# EAGLE design 85veegashield_v2 (EAGLE 7.5.0)
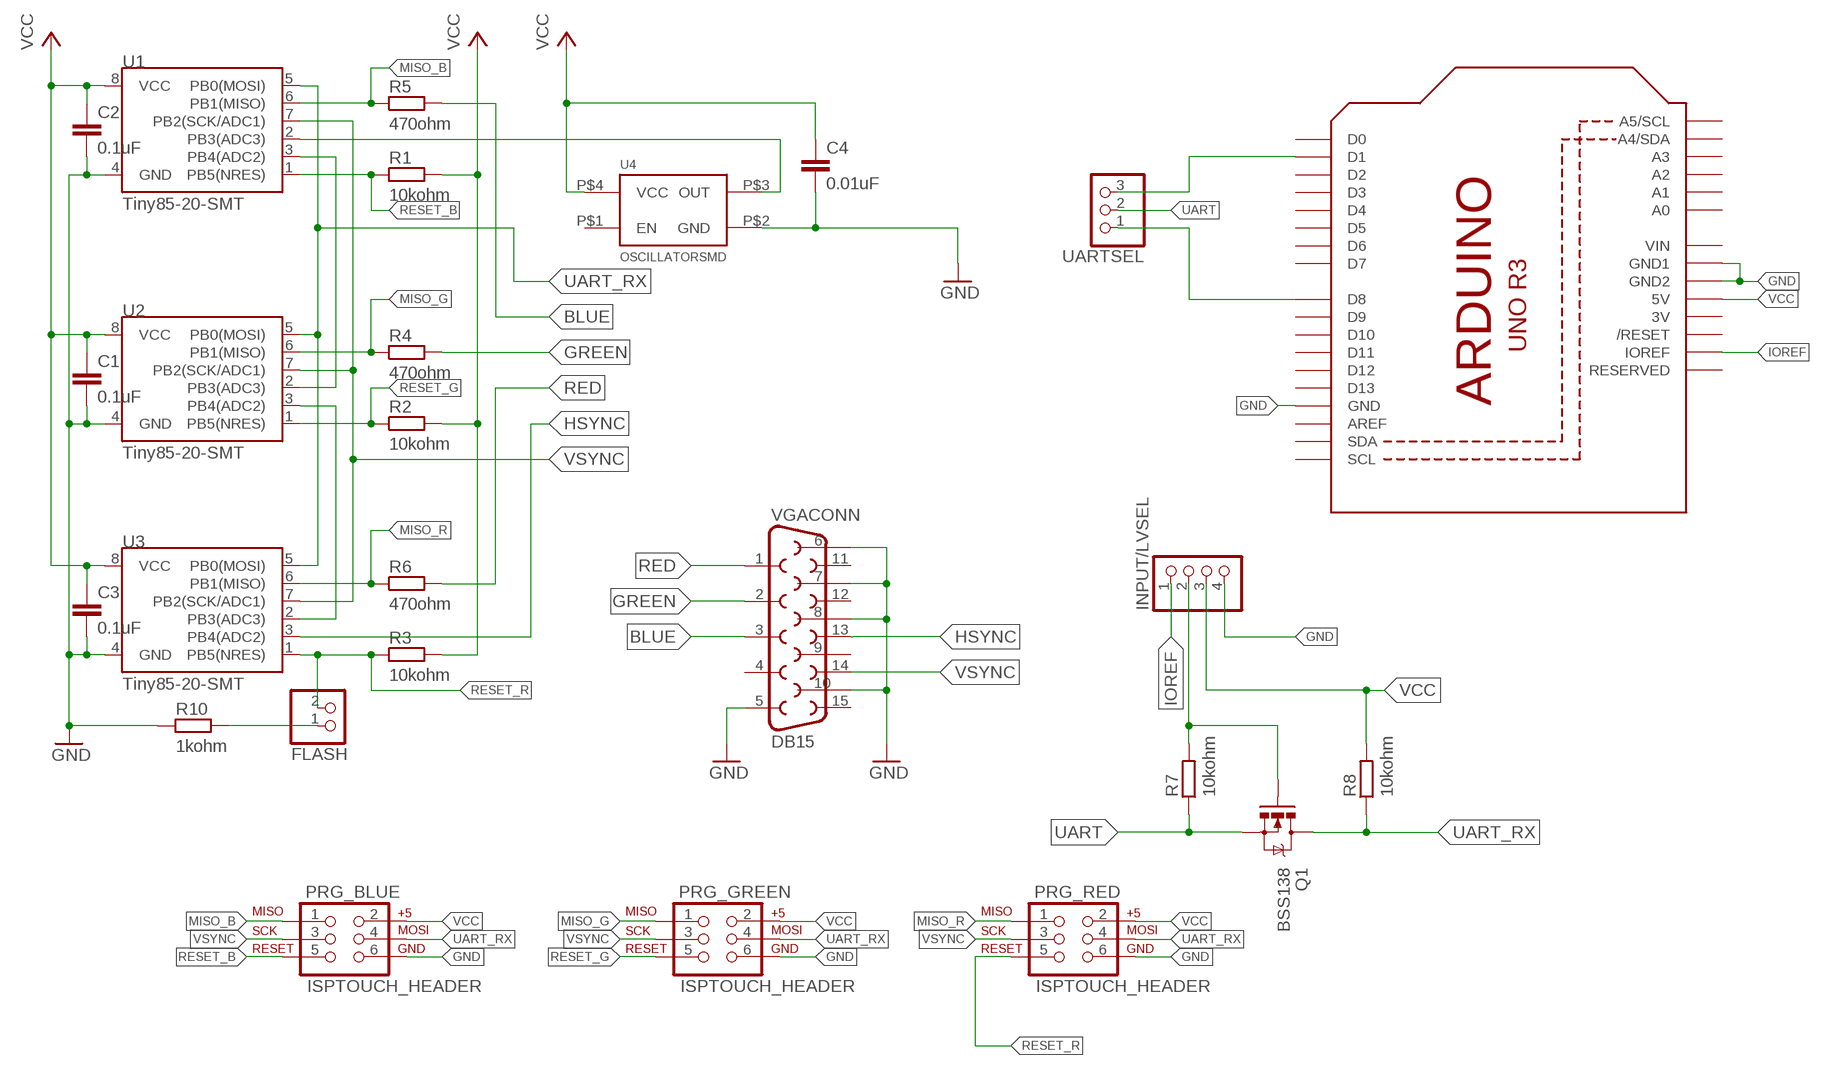
[diagram p0: schematic, sheet 1]

## Parts
C1  0.1uF  CAP0603-CAP  [0603-CAP]
C2  0.1uF  CAP0603-CAP  [0603-CAP]
C3  0.1uF  CAP0603-CAP  [0603-CAP]
C4  0.01uF  CAP0603-CAP  [0603-CAP]
FLASH  PINHD-1X02_2.54-S  [1X02-S]
INPUT/LVSEL  PINHD-1X04_2.54-S  [1X04-S]
PRG_BLUE  ISPTOUCH_HEADER  [AVX_9188_6-WAY_MATING_GUIDE]
PRG_GREEN  ISPTOUCH_HEADER  [AVX_9188_6-WAY_MATING_GUIDE]
PRG_RED  ISPTOUCH_HEADER  [AVX_9188_6-WAY_MATING_GUIDE]
Q1  BSS138  MOSFET-NCHANNELBSS138  [SOT23]
R1  10kohm  RESISTOR  [R0603]
R2  10kohm  RESISTOR  [R0603]
R3  10kohm  RESISTOR  [R0603]
R4  470ohm  RESISTOR  [R0603]
R5  470ohm  RESISTOR  [R0603]
R6  470ohm  RESISTOR  [R0603]
R7  10kohm  RESISTOR  [R0603]
R8  10kohm  RESISTOR  [R0603]
R10  1kohm  RESISTOR  [R0603]
U1  Tiny85-20-SMT  ATTINY45TINY85-20-SMT  [SO08-EIAJ]
U2  Tiny85-20-SMT  ATTINY45TINY85-20-SMT  [SO08-EIAJ]
U3  Tiny85-20-SMT  ATTINY45TINY85-20-SMT  [SO08-EIAJ]
U4  OSCILLATORSMD  [CRYSTAL-SMD-7X5]
U$1  ARDUINOR3-DIMENSION  [ARDUINOR3]
UARTSEL  PINHD-1X03_2.54-S  [1X03-S]
VGACONN  DB15  [DB15]

## Nets
BLUE: R5.2 VGACONN.3
FOO: INPUT/LVSEL.2 Q1.1(G) R7.2
GND: C1.2 C2.2 C3.2 C4.2 INPUT/LVSEL.4 PRG_BLUE.6 PRG_GREEN.6 PRG_RED.6 R10.1 U1.4(GND) U2.4(GND) U3.4(GND) U4.P$2(GND) U$1.GND U$1.GND1 U$1.GND2 VGACONN.5 VGACONN.6 VGACONN.7 VGACONN.8 VGACONN.10
GREEN: R4.2 VGACONN.2
HSYNC: U3.3(PB4(ADC2)) VGACONN.13
IOREF: INPUT/LVSEL.1 U$1.IOREF
MISO_B: PRG_BLUE.1 R5.1 U1.6(PB1(MISO))
MISO_G: PRG_GREEN.1 R4.1 U2.6(PB1(MISO))
MISO_R: PRG_RED.1 R6.1 U3.6(PB1(MISO))
N$1: U1.2(PB3(ADC3)) U4.P$3(OUT)
N$2: U1.3(PB4(ADC2)) U2.2(PB3(ADC3))
N$3: U2.3(PB4(ADC2)) U3.2(PB3(ADC3))
N$4: U$1.D1 UARTSEL.3
N$6: FLASH.1 R10.2
N$11: U$1.D8 UARTSEL.1
RED: R6.2 VGACONN.1
RESET_B: PRG_BLUE.5 R1.1 U1.1(PB5(NRES))
RESET_G: PRG_GREEN.5 R2.1 U2.1(PB5(NRES))
RESET_R: FLASH.2 PRG_RED.5 R3.1 U3.1(PB5(NRES))
UART: Q1.2(S) R7.1 UARTSEL.2
UART_RX: PRG_BLUE.4 PRG_GREEN.4 PRG_RED.4 Q1.3(D) R8.1 U1.5(PB0(MOSI)) U2.5(PB0(MOSI)) U3.5(PB0(MOSI))
VCC: C1.1 C2.1 C3.1 C4.1 INPUT/LVSEL.3 PRG_BLUE.2 PRG_GREEN.2 PRG_RED.2 R1.2 R2.2 R3.2 R8.2 U1.8(VCC) U2.8(VCC) U3.8(VCC) U4.P$4(VCC) U$1.5V
VSYNC: PRG_BLUE.3 PRG_GREEN.3 PRG_RED.3 U1.7(PB2(SCK/ADC1)) U2.7(PB2(SCK/ADC1)) U3.7(PB2(SCK/ADC1)) VGACONN.14
Unconnected: U4.P$1(EN) U$1.A0 U$1.A1 U$1.A2 U$1.A3 U$1.A4(A4/SDA) U$1.A5(A5/SCL) U$1.AREF U$1.D0 U$1.D2 U$1.D3 U$1.D4 U$1.D5 U$1.D6 U$1.D7 U$1.D9 U$1.D10 U$1.D11 U$1.D12 U$1.D13 U$1.RESERVED U$1.RESET(/RESET) U$1.SCL U$1.SDA VGACONN.4 VGACONN.9 VGACONN.11 VGACONN.12 VGACONN.15

## Power pins joined to a net without a drawn wire
3V: U$1.3V
VIN: U$1.VIN

## Library data of the parts
C1-C4 = SparkFun-Capacitors:CAP: Capacitor Standard 0603 ceramic capacitor, and 0.1" leaded capacitor.
FLASH = pinhead-2:PINHD-1X02: PIN HEADER
INPUT/LVSEL = pinhead-2:PINHD-1X04: PIN HEADER
PRG_BLUE PRG_GREEN PRG_RED = prg_header:ISPTOUCH: ISPtouch for AVR Microcontrollers This 6-pin ISP connector for AVR programming does not require any part on the PCB, but an adapter for a common 6-pin programmer.
Q1 = SparkFun-DiscreteSemi:MOSFET-NCHANNEL: Common NMOSFET Parts MFG P/N Store ID Prod ID FDD8780 TRANS-09984 SI7820DN TRANS-11055 FDS6630A IC-08089 2N7002PW TRANS-11151 FQP30N06L COM-10213 TRANS-10060 BSS123LT1G TRANS-08345 BSS138 TRANS-00830 BS170 2N7000; PROD_ID: TRANS-00830
R1-R8 R10 = BaseApp:RESISTOR: Resistance Package :- 0603 Mount :-Surface mount
U1-U3 = SparkFun-DigitalIC:ATTINY45: Atmel 8-pin 2/4/8kB flash uC; PROD_ID: IC-09092
U4 = SparkFun-FreqCtrl:OSCILLATOR: Generic 5x3 and 7x5 oscillators
U$1 = adafruit:ARDUINOR3: This is a new object for the new Arduino R3 - with extra pins that you may want to use (such as IOref, and duplicated A4/A5
UARTSEL = pinhead-2:PINHD-1X03: PIN HEADER
VGACONN = SparkFun-Connectors:DB15: DB15 / VGA right angle through-hole female connector.

## Board
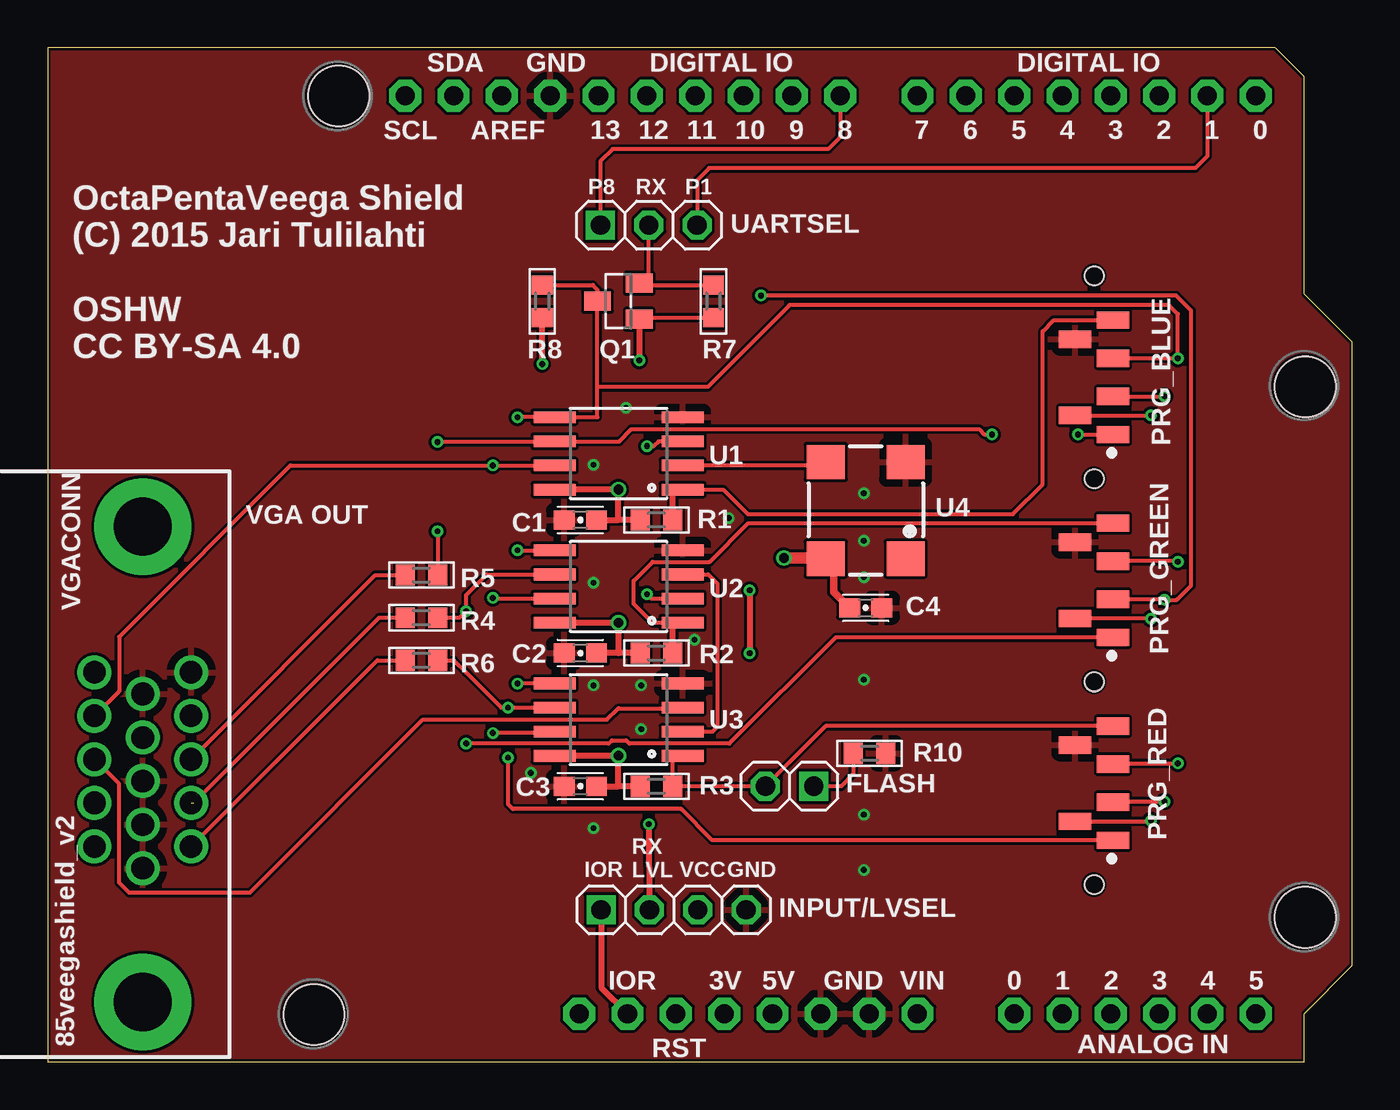
[diagram p1: board, top side]
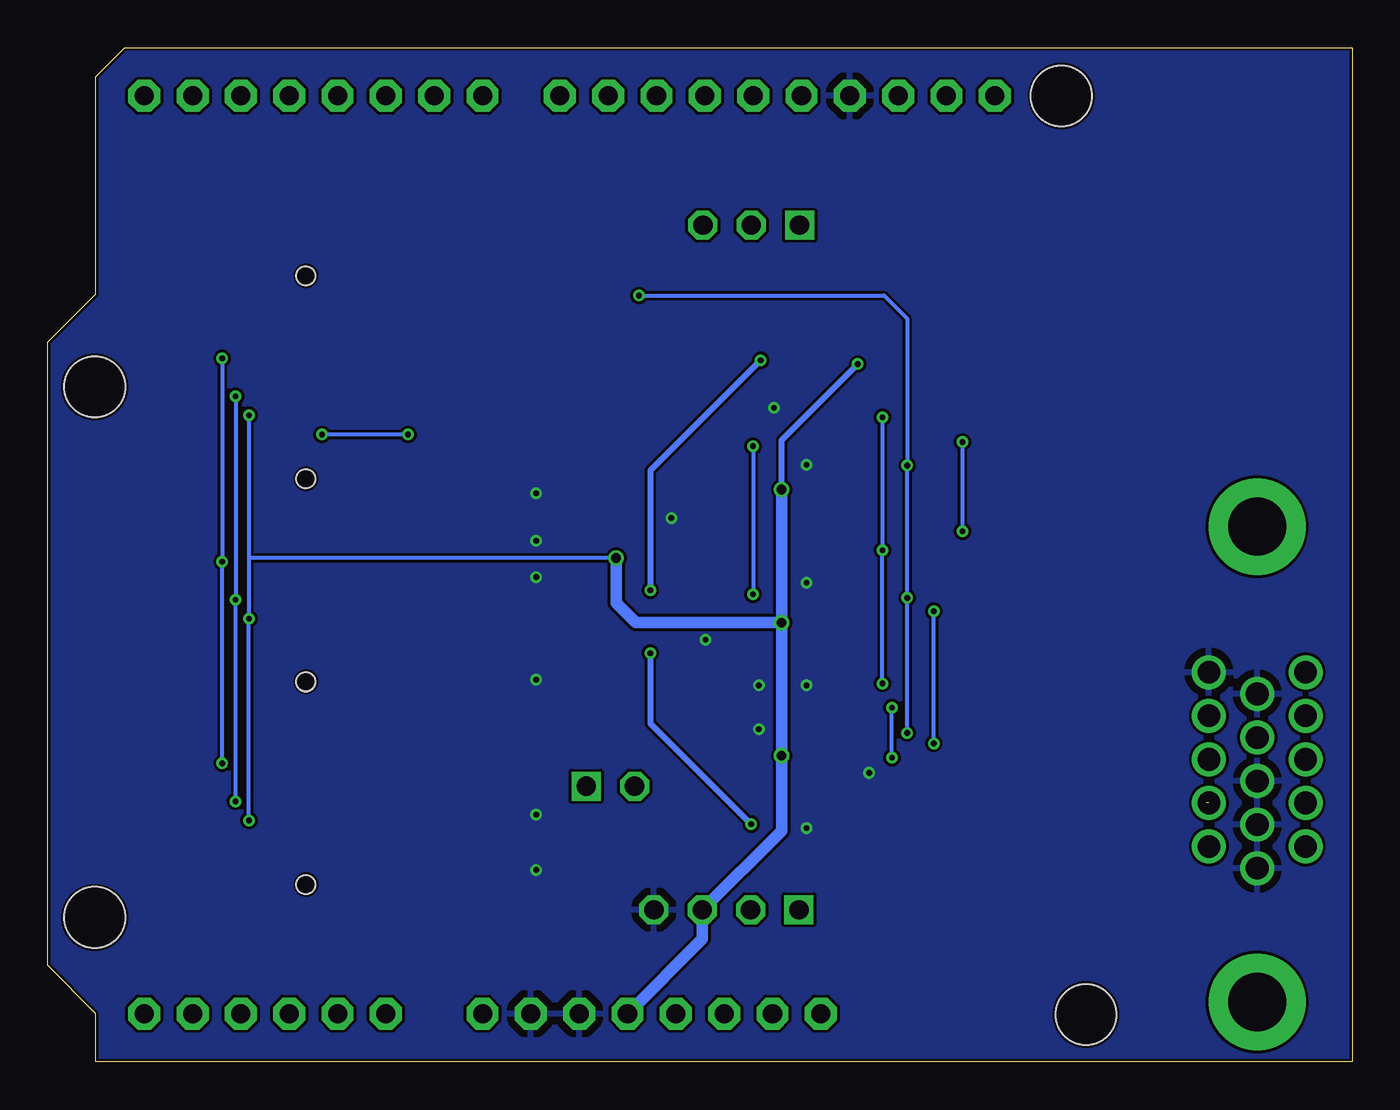
[diagram p2: board, bottom side, seen from below]

Size 68.58 x 53.34 mm. Coordinates in mm from the lower left corner, seen from the top.
Outline: 0,53.33 0,0
Copper layers (1*16): Top 0.035mm / dielectric 1.5mm / Bottom 0.035mm
Design rules "tagsu *": minimum track width 8mil, minimum drill 0.3mm, track to track 6mil, track to pad 6mil, pad to pad 6mil, via to via 6mil, smd to smd 0mil, copper to edge 0.15mm, drill to drill 0.4mm, minimum pad ring 10mil, minimum via ring 6mil, stop-mask expansion 2mil, vias tented up to drill 100mil, thermal gap 0.4mm

### Footprints (pad centres in the part's own frame; a part is rotated, then mirrored left to right if it is on the bottom)
0603-CAP = smd 1.1 x 1: 1 -0.85,0; 2 0.85,0
1X02-S = drill 1.016 square: 1 -1.27,0 | drill 1.016 octagon: 2 1.27,0
1X04-S = drill 1.016 square: 1 -3.81,0 | drill 1.016 octagon: 2 -1.27,0; 3 1.27,0; 4 3.81,0
AVX_9188_6-WAY_MATING_GUIDE = smd 0.9 x 1.7: 1 -3,-1; 2 -2,1; 3 -1,-1; 4 1,-1; 5 3,-1; 6 2,1 | hole 1: -5.334,0; 5.334,0
SOT23 = smd 1 x 1.4: 1 -0.95,-1.1; 2 0.95,-1.1; 3 0,1.1
R0603 = smd 1 x 1.1: 1 -0.85,0; 2 0.85,0
SO08-EIAJ = smd 0.61 x 2.21: 1 -1.905,-3.378; 2 -0.635,-3.378; 3 0.635,-3.378; 4 1.905,-3.378; 5 1.905,3.353; 6 0.635,3.353; 7 -0.635,3.353; 8 -1.905,3.353
CRYSTAL-SMD-7X5 = smd 1.8 x 2: P$1 -2.54,-2.1; P$2 2.54,-2.1; P$3 2.54,2.1; P$4 -2.54,2.1
ARDUINOR3 = drill 1 pad 1.676 octagon: 3V 35.56,2.54; 5V 38.1,2.54; A0 50.8,2.54; A1 53.34,2.54; A2 55.88,2.54; A3 58.42,2.54; A4 60.96,2.54; A5 63.5,2.54; AREF 23.876,50.8; D0 63.5,50.8; D1 60.96,50.8; D2 58.42,50.8; D3 55.88,50.8; D4 53.34,50.8; D5 50.8,50.8; D6 48.26,50.8; D7 45.72,50.8; D8 41.656,50.8; D9 39.116,50.8; D10 36.576,50.8; D11 34.036,50.8; D12 31.496,50.8; D13 28.956,50.8; GND 26.416,50.8; GND1 43.18,2.54; GND2 40.64,2.54; IOREF 30.48,2.54; RESERVED 27.94,2.54; RESET 33.02,2.54; SCL 18.796,50.8; SDA 21.336,50.8; VIN 45.72,2.54 | hole 3.2: 15.3,50.8; 14,2.5; 66.1,7.6; 66.1,35.5
1X03-S = drill 1.016 square: 1 -2.54,0 | drill 1.016 octagon: 2 0,0; 3 2.54,0
DB15 = drill 1.19: 1 -4.32,-7.62; 2 -2.03,-7.62; 3 0.26,-7.62; 4 2.55,-7.62; 5 4.84,-7.62; 6 -5.46,-5.08; 7 -3.17,-5.08; 8 -0.88,-5.08; 9 1.41,-5.08; 10 3.7,-5.08; 11 -4.32,-2.54; 12 -2.03,-2.54; 13 0.26,-2.54; 14 2.55,-2.54; 15 4.84,-2.54 | drill 3.05 pad 5.08: G1 -12.5,-5.08; G2 12.5,-5.08

### Placement (x,y rotation side)
C1  28,28.5 180 top
C2  28,21.5 180 top
C3  28,14.5 180 top
C4  43,23.88 0 top
FLASH  39,14.5 180 top
INPUT/LVSEL  32.9,8 0 top
PRG_BLUE  55,36 90 top
PRG_GREEN  55,25.33 90 top
PRG_RED  55,14.66 90 top
Q1  30,40 90 top
R1  32,28.5 180 top
R2  32,21.5 180 top
R3  32,14.5 180 top
R4  19.65,23.36 180 top
R5  19.65,25.6 180 top
R6  19.65,21.12 180 top
R7  35,40 270 top
R8  26,40 270 top
R10  43.21,16.23 180 top
U1  30,32 90 top
U2  30,25 90 top
U3  30,18 90 top
U4  43,29 90 top
U$1  0,0 0 top
UARTSEL  31.6,44 0 top
VGACONN  -0.08,15.65 90 top

### Tracks (layer width: path | path; a pad name or v marks a point on that pad's centre or on a via)
BLUE
  Top 0.203: VGACONN.3 17.23,25.6 R5.2
FOO  (via drill 0.3)
  Top 0.203: Q1.1 31.2,39.15 R7.2
  Top 0.305: Q1.1 v31.1,36.9 | v36.9,24.8 v36.9,21.5 | v31.6,12.5 INPUT/LVSEL.2
  Bottom 0.305: v31.1,36.9 36.9,31.1 v36.9,24.8 | v36.9,21.5 36.9,17.8 v31.6,12.5
GND  (via drill 0.3)
  other vias: 42.9,29.9 42.9,27.4 42.9,25.5 25.4,15.2 28.7,19.8 31.2,19.8 31.2,17.5 35.8,28.6 28.7,25.2 34,22.2 42.9,20.1 28.7,31.4 30.4,34.4 42.9,13 42.9,10.1 28.7,12.3
  pour Top: 0,0 68.7,0 68.7,53.4 0,53.4
  pour Bottom: 0,0 68.6,0 68.6,53.2 0,53.2
GREEN  (1 unrouted)
  Top 0.203: 7.69,13.62 17.43,23.36 R4.2
HSYNC
  Top 0.203: U3.3 33.34,18.6 30,18.6 29.4,18 19.72,18 10.62,8.9 4.28,8.9 3.76,9.42 3.76,14.62 VGACONN.13
IOREF
  Top 0.305: INPUT/LVSEL.1 29.11,3.91 U$1.IOREF
MISO_B  (via drill 0.3)
  Top 0.203: 26.61,32.6 v20.5,32.6 | v20.5,27.9 R5.1 | U1.6 30.04,32.63 30.68,33.27 48.96,33.27 49.24,32.99 v49.63,32.99 | v54.15,32.99 PRG_BLUE.1
  Top 0.254: U1.6 26.61,32.6
  Bottom 0.203: v20.5,32.6 v20.5,27.9 | v49.63,32.99 v54.15,32.99
MISO_G  (via drill 0.3)
  Top 0.203: R4.1 21.66,23.36 v22,23.7 22,24.55 23.08,25.64 U2.6 | PRG_GREEN.1 41.43,22.33 35.84,16.74 30.58,16.74 30.4,16.92 29.67,16.92 29.49,16.74 v22,16.74 v22,16.75
  Bottom 0.203: v22,16.75 v22,23.7
MISO_R  (via drill 0.3)
  Top 0.203: R6.1 21.35,21.12 22,20.47 23.84,18.64 v24.2,18.64 U3.6 | PRG_RED.1 34.94,11.66 33.3,13.3 24.45,13.3 24.2,13.55 v24.2,16
  Bottom 0.203: v24.2,16 v24.2,18.64
N$1
  Top 0.203: U4.P$3 40.83,31.36 U1.2
N$2  (via drill 0.3)
  Top 0.203: U1.3 32.11,32.63 31.86,32.38 v31.5,32.38 | U2.2 31.73,24.36 v31.5,24.6
  Bottom 0.203: v31.5,32.38 v31.5,24.6
N$3
  Top 0.203: U2.3 34.72,25.64 35.2,25.15 35.2,17.62 34.95,17.36 U3.2
N$4
  Top 0.203: U$1.D1 60.96,47.63 60.33,47 34.77,47 34.14,46.37 UARTSEL.3
N$6
  Top 0.203: R10.2 42.35,15.13 41.72,14.5 FLASH.1
N$11
  Top 0.203: U$1.D8 41.66,48.63 41.02,48 29.7,48 29.06,47.37 UARTSEL.1
RED
  Top 0.203: VGACONN.1 17.33,21.12 R6.2
RESET_B
  Top 0.203: U1.1 35.51,30.09 36.8,28.8 50.73,28.8 52.3,30.37 52.3,38.41 52.89,39 PRG_BLUE.5
  Top 0.305: R1.1 32.85,30.09 U1.1
RESET_G
  Top 0.203: PRG_GREEN.5 36.83,28.33 34.8,26.3 31.8,26.3 30.8,25.3 30.8,24.09 31.8,23.09 32.85,23.09
  Top 0.305: R2.1 32.85,23.09 U2.1
RESET_R
  Top 0.203: 32.85,16.09 R3.1 FLASH.2 40.89,17.66 PRG_RED.5
  Top 0.305: 32.85,16.09 U3.1
UART
  Top 0.203: R7.1 31.2,40.85 Q1.2 31.35,40.95 31.6,41.2 UARTSEL.2
UART_RX  (via drill 0.3)
  Top 0.203: v24.7,33.9 v24.7,33.91 U1.5 28.9,33.91 28.9,35.5 | v24.7,26.9 v24.7,26.91 U2.5 | U3.5 v24.7,19.9 | 28.9,35.5 Q1.3 28.9,40.61 28.66,40.85 R8.1 | PRG_BLUE.4 v59.4,37 59.4,39.34 58.94,39.8 39,39.8 34.7,35.5 28.9,35.5 | v59.4,26.3 59.4,26.33 PRG_GREEN.4 | PRG_RED.4 56,15.7 v59.4,15.7
  Bottom 0.203: v24.7,33.9 v24.7,26.9 v24.7,19.9 | v59.4,37 v59.4,26.3 v59.4,15.7
VCC  (via drill 0.3, 0.5)
  Top 0.203: PRG_RED.2 58,12.66 v58,12.7 | v58,23.3 58,23.33 PRG_GREEN.2 | PRG_BLUE.2 v58,34
  Top 0.305: U3.8 v30,16.09 v30,16.1 30,14.5 | C3.1 30,14.5 | v30,23.09 U2.8 | 30,21.5 C2.1 | v30,23.09 30,21.5 | U1.8 v30,30.09 v30,30.1 30,28.5 | C1.1 30,28.5 | U4.P$4 41.07,26.46 41.32,26.21 | v26,36.7 R8.2 | R2.2 30,21.5 | v30,23.09 v30,23.1 | R1.2 30,28.5 | R3.2 30,14.5
  Top 0.406: 41.32,26.21 41.32,24.71 C4.1
  Top 0.61: v38.7,26.5 40.86,26.5 U4.P$4
  Bottom 0.203: v58,12.7 v58,23.3 58,26.5 | v58,34 58,26.5 | v38.7,26.5 58,26.5
  Bottom 0.305: v30,30.1 30,32.7 v26,36.7
  Bottom 0.61: v30,23.1 v30,16.1 30,12.14 INPUT/LVSEL.3 34.17,6.47 U$1.5V | v30,23.1 v30,30.1 | v30,23.1 37.66,23.1 38.7,24.14 v38.7,26.5
VSYNC  (via drill 0.3)
  Top 0.203: U1.7 v23.4,31.36 12.77,31.36 3.76,22.36 3.76,19.5 VGACONN.14 | U3.7 26.65,17.3 v23.4,17.3 | v23.4,24.4 23.5,24.36 U2.7 | PRG_RED.3 56,13.7 v58.7,13.7 | PRG_GREEN.3 58.7,24.33 v58.7,24.3 59.34,24.3 60.1,25.06 60.1,39.51 59.31,40.3 v37.5,40.3 | PRG_BLUE.3 v58.7,35
  Bottom 0.203: v23.4,17.3 v23.4,24.4 v23.4,31.36 23.4,39.09 24.61,40.3 v37.5,40.3 | v58.7,13.7 v58.7,24.3 v58.7,35

### Text on the board
tPlace: P8 | RX | P1 | OctaPentaVeega Shield / (C) 2015 Jari Tulilahti / / OSHW / CC BY-SA 4.0 | VGA OUT | IOR | RX / LVL | VCC | GND